# Altium schematic sheet garden.SchDoc
size 400 x 260 mm; SheetNumber: 1; SheetTotal: 1
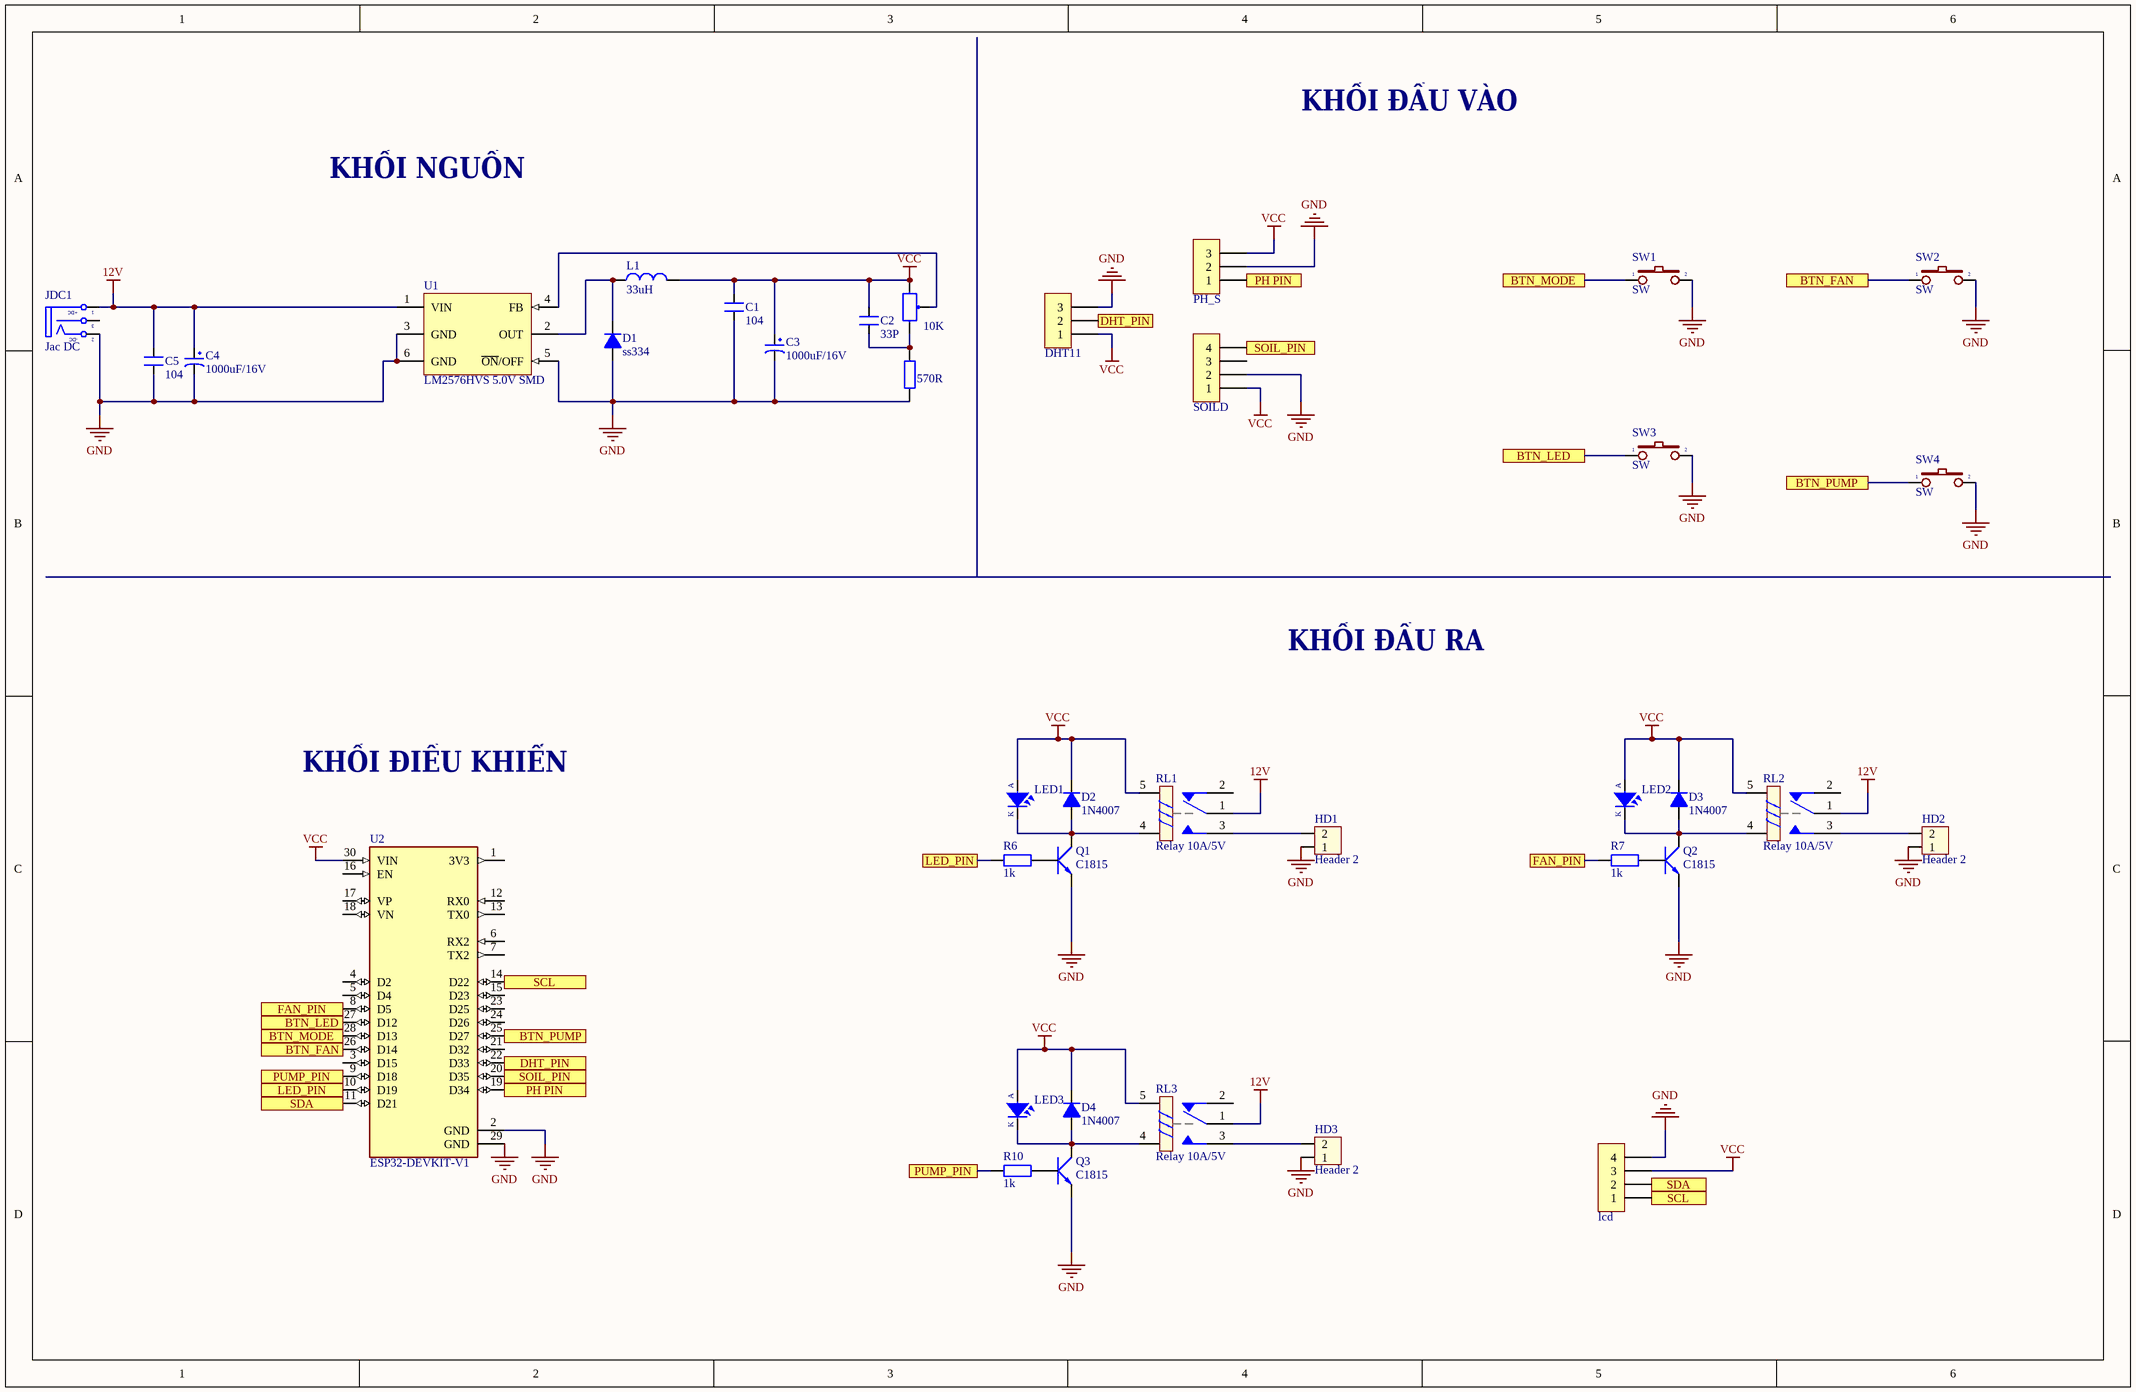
[diagram p0: garden.SchDoc]

## Parts
C1  104  [CN1]
C2  33P  [CN1]
C3  1000uF/16V  [CP1.5/3.4]
C4  1000uF/16V  [CP1.5/3.4]
C5  104  [CN1]
D1  ss334  [D1A]
D2  1N4007  [D1A]
D3  1N4007  [D1A]
D4  1N4007  [D1A]
H1  PH_S  [XH2.54M-3]
H2  DHT11  [XH2.54M-3]
H3  SOILD  [XH2.54M-4]
H4  lcd  [XH2.54M-4]
HD1  Header 2  [KF301-2P]
HD2  Header 2  [KF301-2P]
HD3  Header 2  [KF301-2P]
JDC1  Jac DC  [DC-IN]
L1  33uH  [L/0.4]
LED1  LED  [LED-5]  (value not drawn)
LED2  LED  [LED-5]  (value not drawn)
LED3  LED  [LED-5]  (value not drawn)
Q1  C1815  [QTO-92]
Q2  C1815  [QTO-92]
Q3  C1815  [QTO-92]
R3  570R  [R1/4W]
R6  1k  [R1/4W]
R7  1k  [R1/4W]
R10  1k  [R1/4W]
RL1  Relay 10A/5V  [RL_SPDT_10A]
RL2  Relay 10A/5V  [RL_SPDT_10A]
RL3  Relay 10A/5V  [RL_SPDT_10A]
SW1  SW  [Nut Nhan 4 Chan Cam 6x6]
SW2  SW  [Nut Nhan 4 Chan Cam 6x6]
SW3  SW  [Nut Nhan 4 Chan Cam 6x6]
SW4  SW  [Nut Nhan 4 Chan Cam 6x6]
U1  LM2576HVS 5.0V SMD  [TO263-5]
U2  ESP32-DEVKIT-V1  [MODULE_ESP32_DEVKIT_V1]
VR1  10K  [VR]

## Ports
BTN_FAN, BTN_LED, BTN_MODE, BTN_PUMP, DHT_PIN, FAN_PIN, LED_PIN, PH PIN, PUMP_PIN, SCL, SDA, SOIL_PIN

## Nets
12V: C4.1 C5.2 JDC1.1(T) RL1.1 RL2.1 RL3.1 U1.1(VIN)
GND: C1.1 C3.2 C4.2 C5.1 D1.1(A) H1.2 H2.3 H3.2 H4.4 HD1.1 HD2.1 HD3.1 JDC1.2(TN) Q1.1(E) Q2.1(E) Q3.1(E) R3.1 SW1.2 SW2.2 SW3.2 SW4.2 U1.3(GND) U1.5(~{ON}/OFF) U1.6(GND) U2.2(GND) U2.29(GND)
VCC: C1.2 C2.2 C3.1 D2.2(K) D3.2(K) D4.2(K) H1.3 H2.1 H3.1 H4.3 L1.2 LED1.1(A) LED2.1(A) LED3.1(A) RL1.5 RL2.5 RL3.5 U2.30(VIN) VR1.1
BTN_FAN: SW2.1 U2.26(D14) ; port BTN_FAN
BTN_LED: SW3.1 U2.27(D12) ; port BTN_LED
BTN_MODE: SW1.1 U2.28(D13) ; port BTN_MODE
BTN_PUMP: SW4.1 U2.25(D27) ; port BTN_PUMP
DHT_PIN: H2.2 U2.22(D33) ; port DHT_PIN
FAN_PIN: R7.1 U2.8(D5) ; port FAN_PIN
LED_PIN: R6.1 U2.10(D19) ; port LED_PIN
PH PIN: H1.1 U2.19(D34) ; port PH PIN
PUMP_PIN: R10.1 U2.9(D18) ; port PUMP_PIN
SCL: H4.1 U2.14(D22) ; port SCL
SDA: H4.2 U2.11(D21) ; port SDA
SOIL_PIN: H3.4 U2.20(D35) ; port SOIL_PIN
NetC2_1: C2.1 R3.2 VR1.3
NetD1_2: D1.2(K) L1.1 U1.2(OUT)
NetD2_1: D2.1(A) LED1.2(K) Q1.2(C) RL1.4
NetD3_1: D3.1(A) LED2.2(K) Q2.2(C) RL2.4
NetD4_1: D4.1(A) LED3.2(K) Q3.2(C) RL3.4
NetHD1_2: HD1.2 RL1.3
NetHD2_2: HD2.2 RL2.3
NetHD3_2: HD3.2 RL3.3
NetQ1_3: Q1.3(B) R6.2
NetQ2_3: Q2.3(B) R7.2
NetQ3_3: Q3.3(B) R10.2
NetU1_4: U1.4(FB) VR1.2

Not connected (* = marked no-connect by the designer): H3 3; JDC1 3(S); RL1 2; RL2 2; RL3 2; U2 1(3V3) 3(D15) 4(D2) 5(D4) 6(RX2) 7(TX2) 12(RX0) 13(TX0) 15(D23) 16(EN) 17(VP) 18(VN) 21(D32) 23(D25) 24(D26)

## Notes on the sheet
- KHỐI ĐẦU VÀO
- KHỐI NGUỒN
- KHỐI ĐẦU RA
- KHỐI ĐIỀU KHIỂN
- (in symbol DCIN) +DC; -DC

## Library data of the parts
C1 C2 C5 = CN1: Cap np  1pF - 472pF; Value: 100pF
C3 C4 = CP4: Cap 1000uF/16V - 220uF/50V; Description 5: 4,7uF>10uF/250V_3,3uF>10uF/400V - 2,2uF>4,7uF/450V; Description 1: 2200uF-3300uF/6,3V - 1000uF-2200uF/10V; Description 2: 1000uF/16V - 470uF => 1000uF/25V - 100uF/100V; Description 3: 330uF>470uF/35V_220uF>470uF/50V_10uF>22uF/250V; Description 4: 220uF => 330uF/63V - 10uF =>33uF/160 - 200V; Value: 1000uF/16V
D1 = D1A: Diode 1A; Value: 1N4007
D2-D4 = D1A: Diode 1A; Value: 1N4007
H1 H2 = Header 3P 2.54 Duc Thang: Cắm; Ten_Linh_Kien: Header 3P XH2.54-3P Đực Thẳng; Don_Vi: Con; Ma_Hang: MH001292; Chung_Loai: Cắm
H3 H4 = Header 4P 2.54 Duc Thang: Cắm; Ten_Linh_Kien: Header 4P XH2.54-4P Đực Thẳng; Don_Vi: Con; Ma_Hang: MH001285; Chung_Loai: Cắm
HD1-HD3 = Hed2: Header 2 (Green); Value: Header 2
JDC1 = DCIN: Jac DC input; Value: Jac DC
L1 = L1: Inductor; Value: 150 mH
LED1-LED3 = LED: LED Single colour Green and Red; Value: LED 3 ly Single Colour
Q1-Q3 = C1815: NPN 600mW, ECB; Value: C1815
R3 R6 R7 R10 = R1/4W: Resistor 1/4W; Value: R1/4W - 1K
RL1-RL3 = Relay 1: Relay SPDT,10A - 12VDC 5 Pin; Value: Relay SPDT, 10A, 12V
SW1-SW4 = SW2: Switch button 2 pin; Value: SW chip 2 pin
U1 = LM2576HVS 5.0V SMD: Dán; Ten_Linh_Kien: LM2576HVS-5.0V BUCK 5V 3A TO263-5; Don_Vi: Con; Ma_Hang: MH002362; Ghi_Chu: *; Kieu_Chan: *; Chung_Loai: Dán
U2 = ESP32-DEVKIT-V1: Dual core, Wi-Fi: 2.4 GHz up to 150 Mbits/s,BLE (Bluetooth Low Energy) and legacy Bluetooth, 32 bits, Up to 240 MHz; MF: Do it; SnapEDA_Link: https://www.snapeda.com/parts/ESP32-DEVKIT-V1/Do+it/view-part/?ref=snap; Package: None; Value: *; MP: ESP32-DEVKIT-V1; Check_prices: https://www.snapeda.com/parts/ESP32-DEVKIT-V1/Do+it/view-part/?ref=eda
VR1 = VR: Var Resistor; Value: VR 10K